# Altium project lab3_shkabara_rasp.PrjPcb
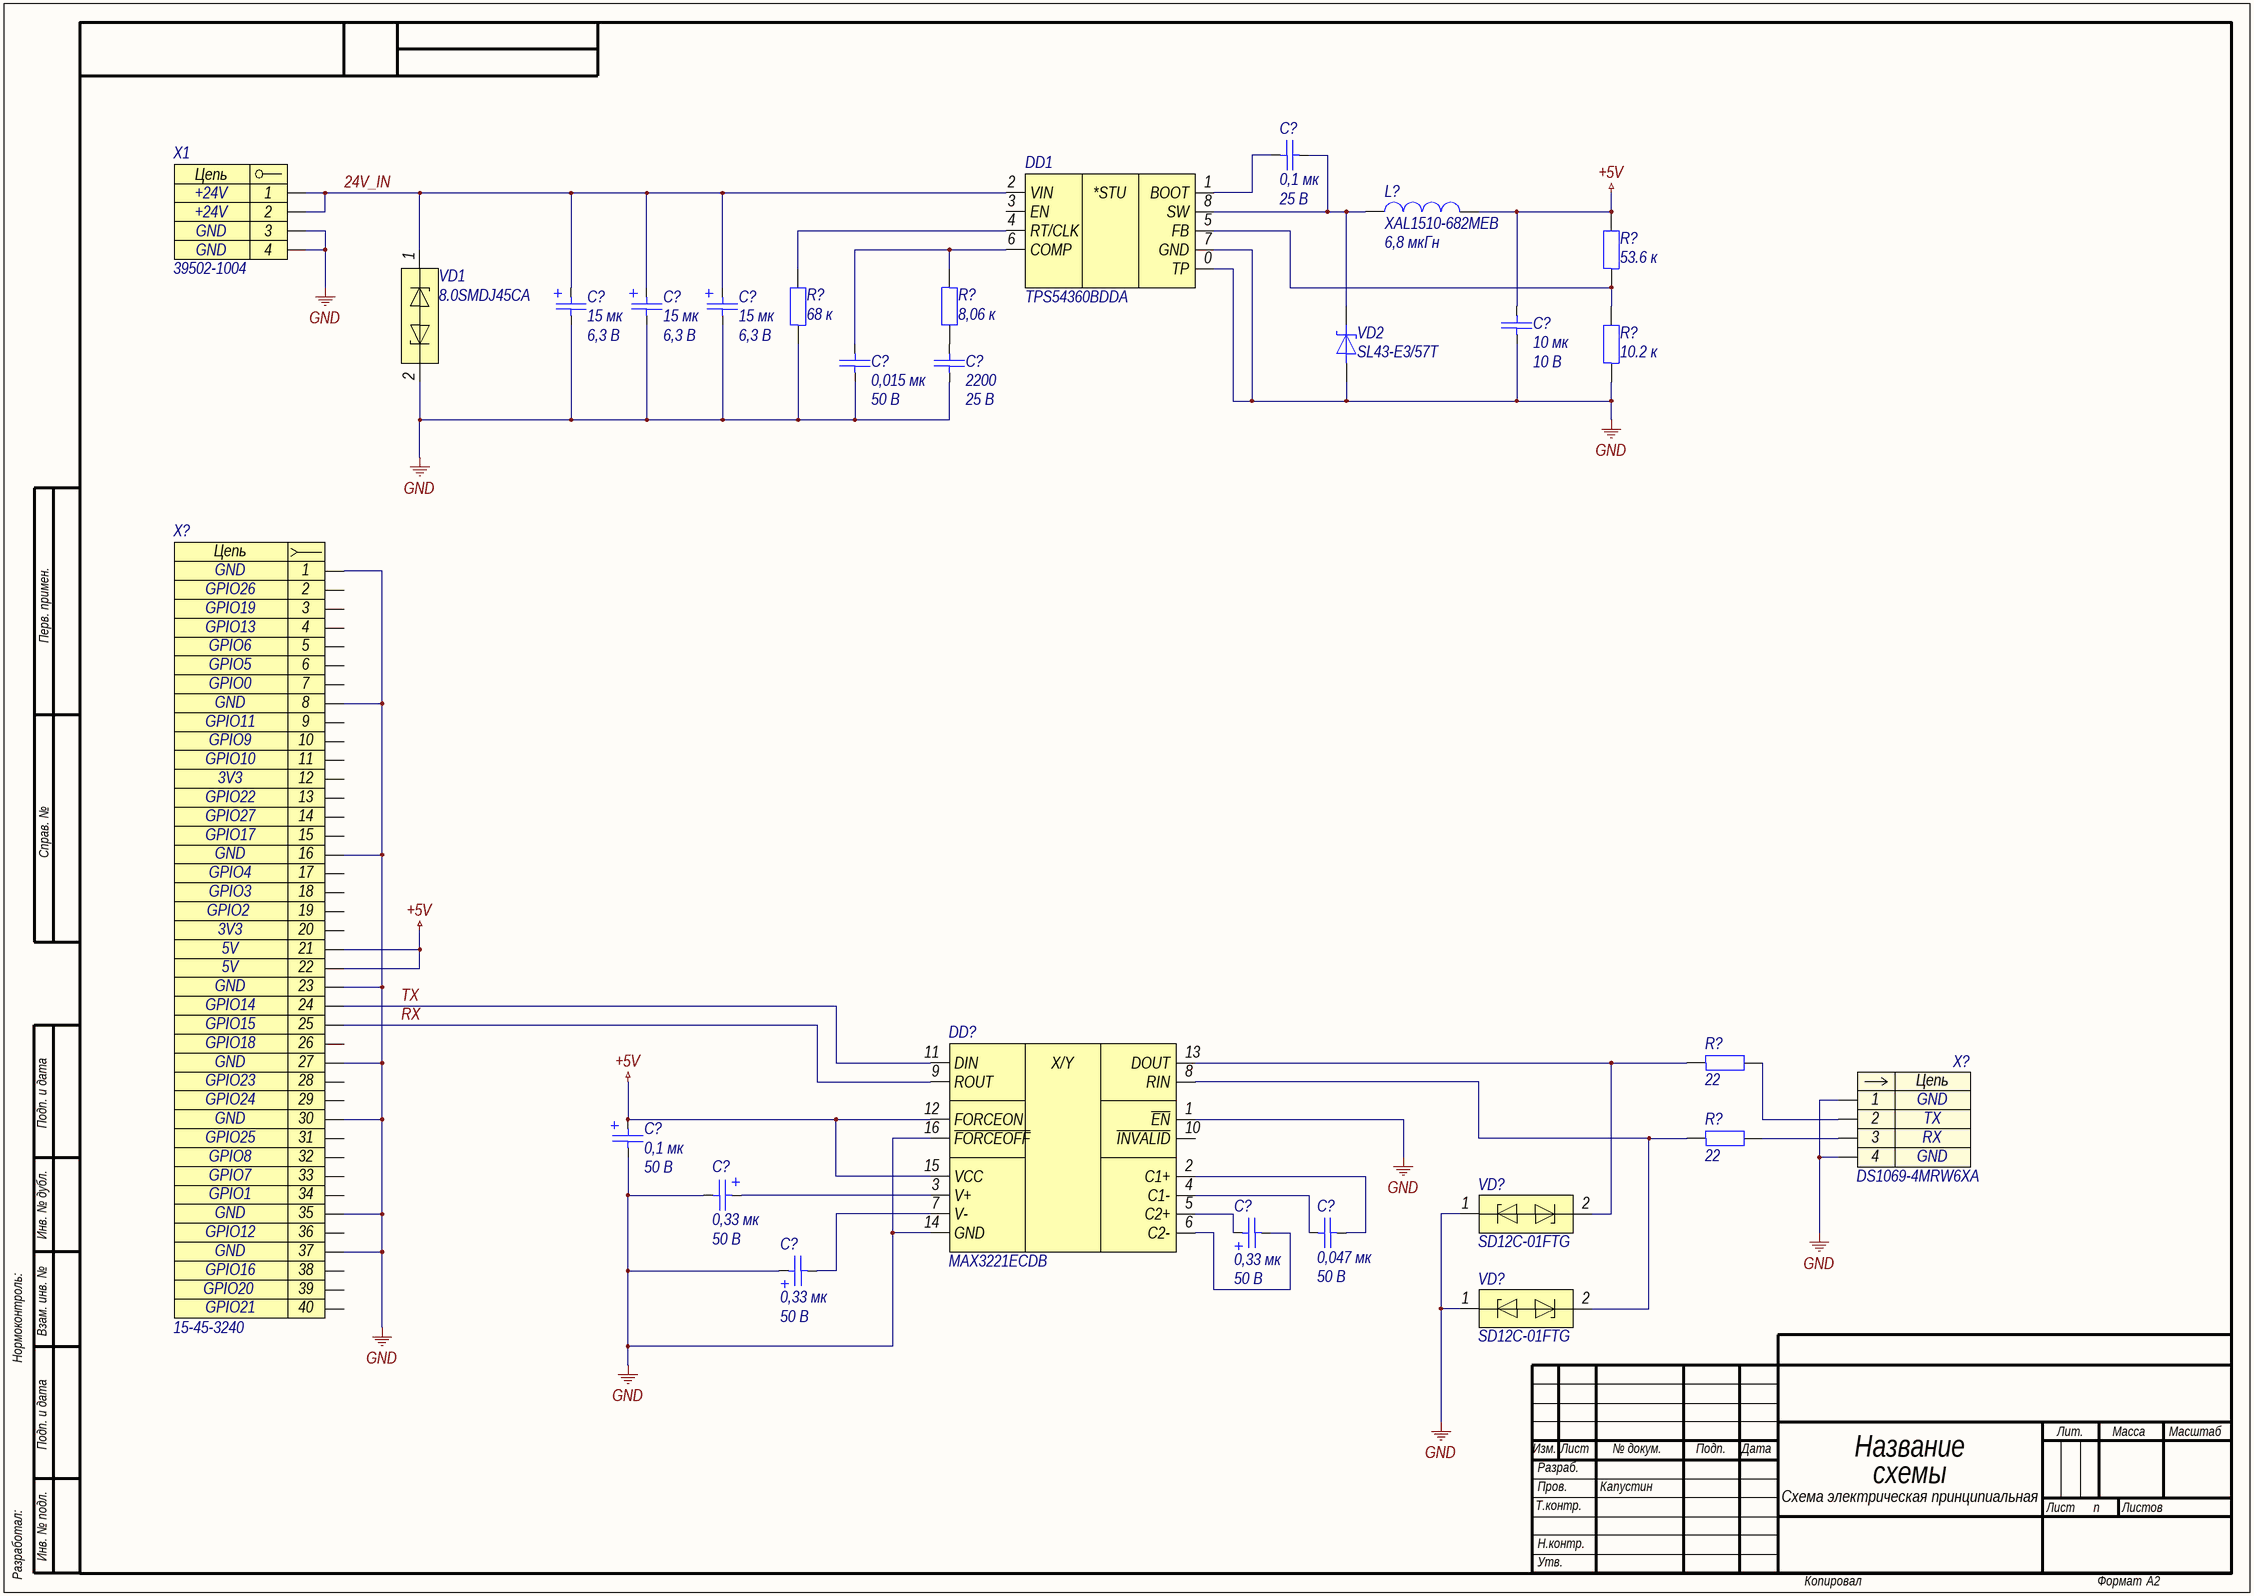
[diagram p0: lab3_shkabara_rasp.SchDoc]
approver: Капустин; check: Капустин; designation: СПБПУ.3331506.026; developer: Шкабара; document_code: Ý3; document_type: Схема электрическая принципиальная; pcb_dec_number: СПБПУ.3331506.026; project: Введите название проекта; sheets_total: 1; title: Введите полное название схемы; title_line_1: Название; title_line_2: схемы
1 sheet, 28 parts. Net scope: global (net labels, ports and power ports of the same name join across sheets).
Board file: lab3_shkabara_rasp.PcbDoc

## Sheet lab3_shkabara_rasp.SchDoc: Введите полное название схемы
size 594 x 420 mm; ApprovedBy: Капустин; CheckedBy: Капустин; DrawnBy: Шкабара; DocumentNumber: СПБПУ.3331506.026Ý3; SheetNumber: n; SheetTotal: 1; DocumentCode: Ý3; ImagePath: СПБПУ.3331506.026

### Parts
(Parts that share a designator on the sheet are numbered #1, #2 ... from top to bottom, then left to right.)
C?#1  0,1 мк  Напряжение: 25 В  [C0402]
C?#2  15 мк  Напряжение: 6,3 В  [C3216-18]
C?#3  15 мк  Напряжение: 6,3 В  [C3216-18]
C?#4  15 мк  Напряжение: 6,3 В  [C3216-18]
C?#5  10 мк  Напряжение: 10 В  [C0805]
C?#6  0,015 мк  Напряжение: 50 В  [C0603]
C?#7  2200  Напряжение: 25 В  [C0603]
C?#8  0,1 мк  Напряжение: 50 В  [C3216-18]
C?#9  0,33 мк  Напряжение: 50 В  [C3528-21]
C?#10  0,33 мк  Напряжение: 50 В  [C3528-21]
C?#11  0,047 мк  Напряжение: 50 В  [C0603]
C?#12  0,33 мк  Напряжение: 50 В  [C3528-21]
DD1  TPS54360BDDA  [HSOIC-8-P127-490X390X170-L84X41-T310X240]
DD?  MAX3221ECDB  [SSOP-16-P65-620X530X200-L75X30]
L?  XAL1510-682MEB  Индуктивность: 6,8 мкГн  [XAL-2-1620X1520X1000]
R?#1  8,06 к  [R0603]
R?#2  53.6 к  [R1218]
R?#3  68 к  [R0603]
R?#4  10.2 к  [R1218]
R?#5  22  [R0603]
R?#6  22  [R0603]
VD1  8.0SMDJ45CA  [DO-214AB-790X590X262]
VD2  SL43-E3/57T  [DO-214AB-790X590X262]
VD?#1  SD12C-01FTG  [SOD-323-257X130X114]
VD?#2  SD12C-01FTG  [SOD-323-257X130X114]
X1  39502-1004  [39502-1004]
X?#1  DS1069-4MRW6XA  [DS1069-4MRW6XA]
X?#2  15-45-3240  [15-45-3240]

### Nets
+5V: C?#5.1 C?#8.1 DD?.12(FORCEON) DD?.15(VCC) L?.2 R?#2.2 X?#2.21 X?#2.22
GND: C?#2.2 C?#3.2 C?#4.2 C?#5.2 C?#6.2 C?#7.2 C?#8.2 C?#9.2 C?#12.1 DD1.0(TP) DD1.7(GND) DD?.1(~{EN}) DD?.14(GND) DD?.16(~{FORCEOFF}) R?#3.1 R?#4.1 VD1.2 VD2.2 VD?#1.1 VD?#2.1 X1.3 X1.4 X?#1.1 X?#1.4 X?#2.1 X?#2.8 X?#2.16 X?#2.23 X?#2.27 X?#2.30 X?#2.35 X?#2.37
24V_IN: C?#2.1 C?#3.1 C?#4.1 DD1.2(VIN) VD1.1 X1.1 X1.2
RX: DD?.9(ROUT) X?#2.25
TX: DD?.11(DIN) X?#2.24
NetC?#1_1: C?#1.1 DD1.8(SW) L?.1 VD2.1
NetC?#1_2: C?#1.2 DD1.1(BOOT)
NetC?#6_1: C?#6.1 DD1.6(COMP) R?#1.1
NetC?#7_1: C?#7.1 R?#1.2
NetC?#9_1: C?#9.1 DD?.3(V+)
NetC?#10_1: C?#10.1 DD?.5(C2+)
NetC?#10_2: C?#10.2 DD?.6(C2-)
NetC?#11_1: C?#11.1 DD?.4(C1-)
NetC?#11_2: C?#11.2 DD?.2(C1+)
NetC?#12_2: C?#12.2 DD?.7(V-)
NetDD1_4: DD1.4(RT/CLK) R?#3.2
NetDD1_5: DD1.5(FB) R?#2.1 R?#4.2
NetDD?_8: DD?.8(RIN) R?#6.1 VD?#2.2
NetDD?_13: DD?.13(DOUT) R?#5.1 VD?#1.2
NetR?#5_2: R?#5.2 X?#1.2
NetR?#6_2: R?#6.2 X?#1.3

Not connected (* = marked no-connect by the designer): DD1 3(EN); DD? 10(~{INVALID}); X?#2 2 3 4 5 6 7 9 10 11 12 13 14 15 17 18 19 20 26 28 29 32 33 34 36 38 39 40

### Notes on the sheet
- Перв. примен.
- Справ. №
- Подп. и дата
- Инв. № дубл.
- Нормоконтроль:
- Взам. инв. №
- Изм.
- Лист
- № докум.
- Подп.
- Дата
- Лит.
- Масса
- Масштаб
- Т.контр.
- Пров.
- Разраб.
- Листов
- Разработал:
- Инв. № подл.
- Н.контр.
- Утв.
- Копировал
- Формат
- А2
- (in symbol dd0006) *STU
- (in symbol dd0015) X/Y
- (in symbol x0043) Цепь
- (in symbol x0049) Цепь
- (in symbol x0054) Цепь; 31

### Library data of the parts
C?#1 = c0062: =Описание; ID: c0062; Фамилия: Паньков; Описание: Конденсатор керамический чип 0402 100 нФ 25 В ±10 %; Наименование: CC0402KRX5R8BB104; Производитель: YAGEO Corp.; Отклонение: ±10 %; Рабочие температуры: от –55 °С до +85 °С; Температурный коэффициент емкости: X5R; Корпус: 0402; Номинал: 0,1 мк; Номинальное напряжение: 25 В; HelpURL: https://www.yageo.com/upload/media/product/productsearch/datasheet/mlcc/UPY-GPHC_X5R_4V-to-50V_26.pdf
C?#2-C?#4 = c0083: =Описание; ID: c0083; Фамилия: Паньков; Описание: Конденсатор танталовый чип 3216-18 15 мкФ 6,3 В ±10 %; Наименование: 293D156X96R3A2TE3; Производитель: Vishay Intertechnology, Inc.; Отклонение: ±10 %; Эквивалентное последовательное сопротивление: 2,9 Ом; Среднеквадратичный размах пульсации тока: 0,16 А; Рабочие температуры: от –55 °С до +125 °С; Корпус: 3216-18; Номинал: 15 мк; Номинальное напряжение: 6,3 В; HelpURL: https://www.vishay.com/capacitors/list/product-40002/
C?#5 = c0124: =Описание; ID: c0124; Фамилия: Паньков; Описание: Конденсатор керамический чип 0805 10 мкФ 10 В ±10 %; Наименование: CC0805KKX7R6BB106; Производитель: YAGEO Corp.; Отклонение: ±10 %; Рабочие температуры: от –55 °С до +125 °С; Температурный коэффициент емкости: X7R; Корпус: 0805; Номинал: 10 мк; Номинальное напряжение: 10 В; HelpURL: https://www.yageo.com/upload/media/product/productsearch/datasheet/mlcc/UPY-GPHC_X7R_6.3V-to-50V_20.pdf
C?#6 = c0042: =Описание; ID: c0042; Фамилия: Жернаков; Описание: Конденсатор керамический чип 0603 15 нФ 50 В ±5 %; Наименование: CC0603JPX7R9BB153; Производитель: YAGEO Corp.; Отклонение: ±5 %; Рабочие температуры: от –55 °С до +125 °С; Температурный коэффициент емкости: X7R; Корпус: 0603; Номинал: 0,015 мк; Номинальное напряжение: 50 В; HelpURL: https://www.yageo.com/upload/media/product/productsearch/datasheet/mlcc/UPY-GPHC_X7R_6.3V-to-50V_20.pdf
C?#7 = c0027: =Описание; ID: c0027; Фамилия: Паньков; Описание: Конденсатор керамический чип 0603 2,2 нФ 25 В ±10 %; Наименование: CC0603KRX7R8BB222; Производитель: YAGEO Corp.; Отклонение: ±10 %; Рабочие температуры: от –55 °С до +125 °С; Температурный коэффициент емкости: X7R; Корпус: 0603; Номинал: 2200; Номинальное напряжение: 25 В; HelpURL: https://www.yageo.com/upload/media/product/productsearch/datasheet/mlcc/UPY-GPHC_X7R_6.3V-to-50V_20.pdf
C?#8 = c0001: =Описание; ID: c0001; Фамилия: Ларионов; Описание: Конденсатор танталовый чип 3216-18 100 нФ 50 В ±10 %; Наименование: 293D104X9050A2TE3; Производитель: Vishay Intertechnology, Inc.; Отклонение: ±10 %; Эквивалентное последовательное сопротивление: 19,0 Ом; Среднеквадратичный размах пульсации тока: 0,06 А; Рабочие температуры: от –55 °С до +125 °С; Корпус: 3216-18; Номинал: 0,1 мк; Номинальное напряжение: 50 В; HelpURL: https://www.vishay.com/capacitors/list/product-40002/
C?#9 C?#10 C?#12 = c0005: =Описание; ID: c0005; Фамилия: Паньков; Описание: Конденсатор танталовый чип 3528-21 330 нФ 50 В ±10 %; Наименование: 293D334X9050B2TE3; Производитель: Vishay Intertechnology, Inc.; Отклонение: ±10 %; Эквивалентное последовательное сопротивление: 10,0 Ом; Среднеквадратичный размах пульсации тока: 0,09 А; Рабочие температуры: от –55 °С до +125 °С; Корпус: 3528-21; Номинал: 0,33 мк; Номинальное напряжение: 50 В; HelpURL: https://www.vishay.com/capacitors/list/product-40002/
C?#11 = c0055: =Описание; ID: c0055; Фамилия: Паньков; Описание: Конденсатор керамический чип 0603 47 нФ 50 В ±10 %; Наименование: CC0603KRX7R9BB473; Производитель: YAGEO Corp.; Отклонение: ±10 %; Рабочие температуры: от –55 °С до +125 °С; Температурный коэффициент емкости: X7R; Корпус: 0603; Номинал: 0,047 мк; Номинальное напряжение: 50 В; HelpURL: https://www.yageo.com/upload/media/product/productsearch/datasheet/mlcc/UPY-GPHC_X7R_6.3V-to-50V_20.pdf
DD1 = dd0006: =Описание; ID: dd0006; Фамилия: Жернаков; Описание: Понижающий преобразователь напряжения 4,5…60 В / 1…58,8 В и 3,5 А; Производитель: Texas Instruments Inc.; Входное напряжение: от 4,5 В до 60 В; Выходное напряжение: от 1,0 В до 58,8 В; Коммутируемый ток: до 3,5 А; Частота переключения: от 100 кГц до 2,5 МГц; Рабочие температуры: от –40 °С до +150 °С; Корпус: HSOIC-8; Наименование: TPS54360BDDA; HelpURL: https://www.ti.com/product/TPS54360B
DD? = dd0015: =Описание; ID: dd0015; Фамилия: Шкабара; Описание: Приемопередатчик RS-232; Производитель: Texas Instruments Inc.; Рабочие температуры: от 0 до +70 °C; Корпус: SSOP-16; Наименование: MAX3221ECDB; HelpURL: https://www.ti.com/product/MAX3221E
L? = l0003: =Описание; ID: l0003; Фамилия: Засецкий; Описание: Катушка индуктивности 6,8 мкГн ±20 %; Производитель: Coilcraft, Inc.; Отклонение: ±20 %; Номинальное активное сопротивление: 4,17 мОм; Максимальное активное сопротивление: 4,6 мОм; Резонансная частота: 11,5 МГц; Номинальный ток (при нагреве на 20 °С/40 °С): 19 А; Ток насыщения: 36 А; Рабочее напряжение: от 0 В до 60 В; Рабочие температуры: от –40 °С до +125 °С; Корпус: 16,2 x 15,2 x 10; Наименование: XAL1510-682MEB; Номинал: 6,8 мкГн; HelpURL: https://www.coilcraft.com/en-us/products/power/shielded-inductors/molded-inductor/xal/xal1510
R?#1 = r0102: =Описание; ID: r0102; Фамилия: Жернаков; Описание: Резистор чип 0603 8,06 кОм ±1 % 0,1 Вт; Наименование: RC0603FR-078K06L; Производитель: YAGEO Corp.; Отклонение: ±1 %; Номинальное напряжение: 75 В; Номинальный ток: 1 А; Рабочие температуры: от –55 °С до +155 °С; Корпус: 0603; Номинал: 8,06 к; HelpURL: https://www.yageo.com/upload/media/product/productsearch/datasheet/rchip/PYu-RC_Group_51_RoHS_L_11.pdf
R?#2 = r0205: =Описание; ID: r0205; Фамилия: Шкабара; Описание: Резистор чип 1218 53.6 кОм ±1 % 1 Вт; Наименование: AA1218FK-0753K6L; Производитель: YAGEO Corp.; Отклонение: ±1 %; Номинальное напряжение: 200 В; Номинальный ток: 6 А; Рабочие температуры: от –55 °С до +155 °С; Корпус: 1218; Примечание: Ряд E96; Номинал: 53.6 к; HelpURL: https://www.yageo.com/upload/media/product/productsearch/datasheet/rchip/PYu-AA_51_RoHS_L_3.pdf
R?#3 = r0136: =Описание; ID: r0136; Фамилия: Паньков; Описание: Резистор чип 0603 68 кОм ±1 % 0,1 Вт; Наименование: RC0603FR-0768KL; Производитель: YAGEO Corp.; Отклонение: ±1 %; Номинальное напряжение: 75 В; Номинальный ток: 1 А; Рабочие температуры: от –55 °С до +155 °С; Корпус: 0603; Примечание: Ряд E24; Номинал: 68 к; HelpURL: https://www.yageo.com/upload/media/product/productsearch/datasheet/rchip/PYu-RC_Group_51_RoHS_L_11.pdf
R?#4 = r0204: =Описание; ID: r0204; Фамилия: Шкабара; Описание: Резистор чип 1218 10.2 кОм ±1 % 1 Вт; Наименование: AA1218FK-0710K2L; Производитель: YAGEO Corp.; Отклонение: ±1 %; Номинальное напряжение: 200 В; Номинальный ток: 6 А; Рабочие температуры: от –55 °С до +155 °С; Корпус: 1218; Примечание: Ряд E96; Номинал: 10.2 к; HelpURL: https://www.yageo.com/upload/media/product/productsearch/datasheet/rchip/PYu-AA_51_RoHS_L_3.pdf
R?#5 R?#6 = r0034: =Описание; ID: r0034; Фамилия: Ларионов; Описание: Резистор чип 0603 22 Ом ±1 % 0,1 Вт; Наименование: RC0603FR-0722RL; Производитель: YAGEO Corp.; Отклонение: ±1 %; Номинальное напряжение: 75 В; Номинальный ток: 1 А; Рабочие температуры: от –55 °С до +155 °С; Корпус: 0603; Примечание: Ряд E24; Номинал: 22; HelpURL: https://www.yageo.com/upload/media/product/productsearch/datasheet/rchip/PYu-RC_Group_51_RoHS_L_11.pdf
VD1 = vd0008: =Описание; ID: vd0008; Фамилия: Шкабара; Описание: Двунаправленная диодная сборка для подавления помех 45 В; Производитель: Littelfuse, Inc.; Корпус: DO-214AB; Наименование: 8.0SMDJ45CA; HelpURL: https://www.littelfuse.com/products/tvs-diodes/surface-mount/8.0smdj.aspx
VD2 = vd0008: =Описание; ID: vd0008; Фамилия: Шкабара; Описание: Диод Шоттки 30 В 4 А; Производитель: Vishay Intertechnology, Inc.; Максимальное прямое напряжение: 0,42 В; Максимальное обратное напряжение: 30 В; Максимальный прямой ток: 4 А; Рабочие температуры: от –55 °С до +150 °С; Корпус: DO-214AB; Наименование: SL43-E3/57T; HelpURL: https://www.vishay.com/diodes/list/product-88742/
VD?#1 VD?#2 = vd0004: =Описание; ID: vd0004; Фамилия: Ларионов; Описание: Двунаправленная диодная сборка для подавления помех 12 В; Производитель: Littelfuse, Inc.; Корпус: SOD-323; Наименование: SD12C-01FTG; HelpURL: https://www.littelfuse.com/products/tvs-diode-arrays/general-purpose-esd-protection/sdc/sd12c_01ftg.aspx
X1 = x0049: =Описание; Contact_1: +24V; Contact_3: GND; ID: x0049; Фамилия: Шкабара; Описание: Terminal Block 4 pin 3,5 мм; Производитель: Molex; Contact_2: +24V; Contact_4: GND; Наименование: 39502-1004; HelpURL: https://www.molex.com/molex/products/part-detail/terminal_blocks/0395021004
X?#1 = x0043: =Описание; Contact_1: GND; Contact_2: TX; Contact_3: RX; ID: x0043; Фамилия: Паньков; Описание: CWF 4 pin Type A 2,5 мм вилка угловой; Производитель: Connfly Electronic Co., Ltd.; Contact_4: GND; Наименование: DS1069-4MRW6XA; HelpURL: http://en.connfly.group/product/xVkr=EusQssAN0gN=Aos=mU+UrVkR9kqEAN0gN0MUR+g+NB+A
X?#2 = x0054: =Описание; Contact_1: GND; Contact_2: GPIO26; Contact_3: GPIO19; Contact_4: GPIO13; Contact_5: GPIO6; Contact_6: GPIO5; Contact_7: GPIO0; Contact_9: GPIO11; Contact_10: GPIO9; Contact_11: GPIO10; Contact_12: 3V3; Contact_13: GPIO22; Contact_14: GPIO27; Contact_15: GPIO17; Contact_17: GPIO4; Contact_18: GPIO3; Contact_19: GPIO2; Contact_21: 5V; Contact_24: GPIO14; Contact_25: GPIO15; Contact_26: GPIO18; Contact_28: GPIO23; Contact_29: GPIO24; Contact_31: GPIO25; Contact_32: GPIO8; Contact_33: GPIO7; Contact_34: GPIO1; Contact_36: GPIO12; Contact_38: GPIO16; Contact_39: GPIO20; Contact_40: GPIO21; ID: x0054; Фамилия: Козлов; Описание: C-Grid 40 pin 2,54 мм гнездо прямой; Производитель: Molex; Contact_8: GND; Contact_16: GND; Contact_20: 3V3; Contact_22: 5V; Contact_23: GND; Contact_27: GND; Contact_30: GND; Contact_35: GND; Contact_37: GND; Наименование: 15-45-3240; HelpURL: https://www.molex.com/molex/products/part-detail/pcb_receptacles/0015453240